# EAGLE design CS-P-USB (EAGLE 6.5.0)
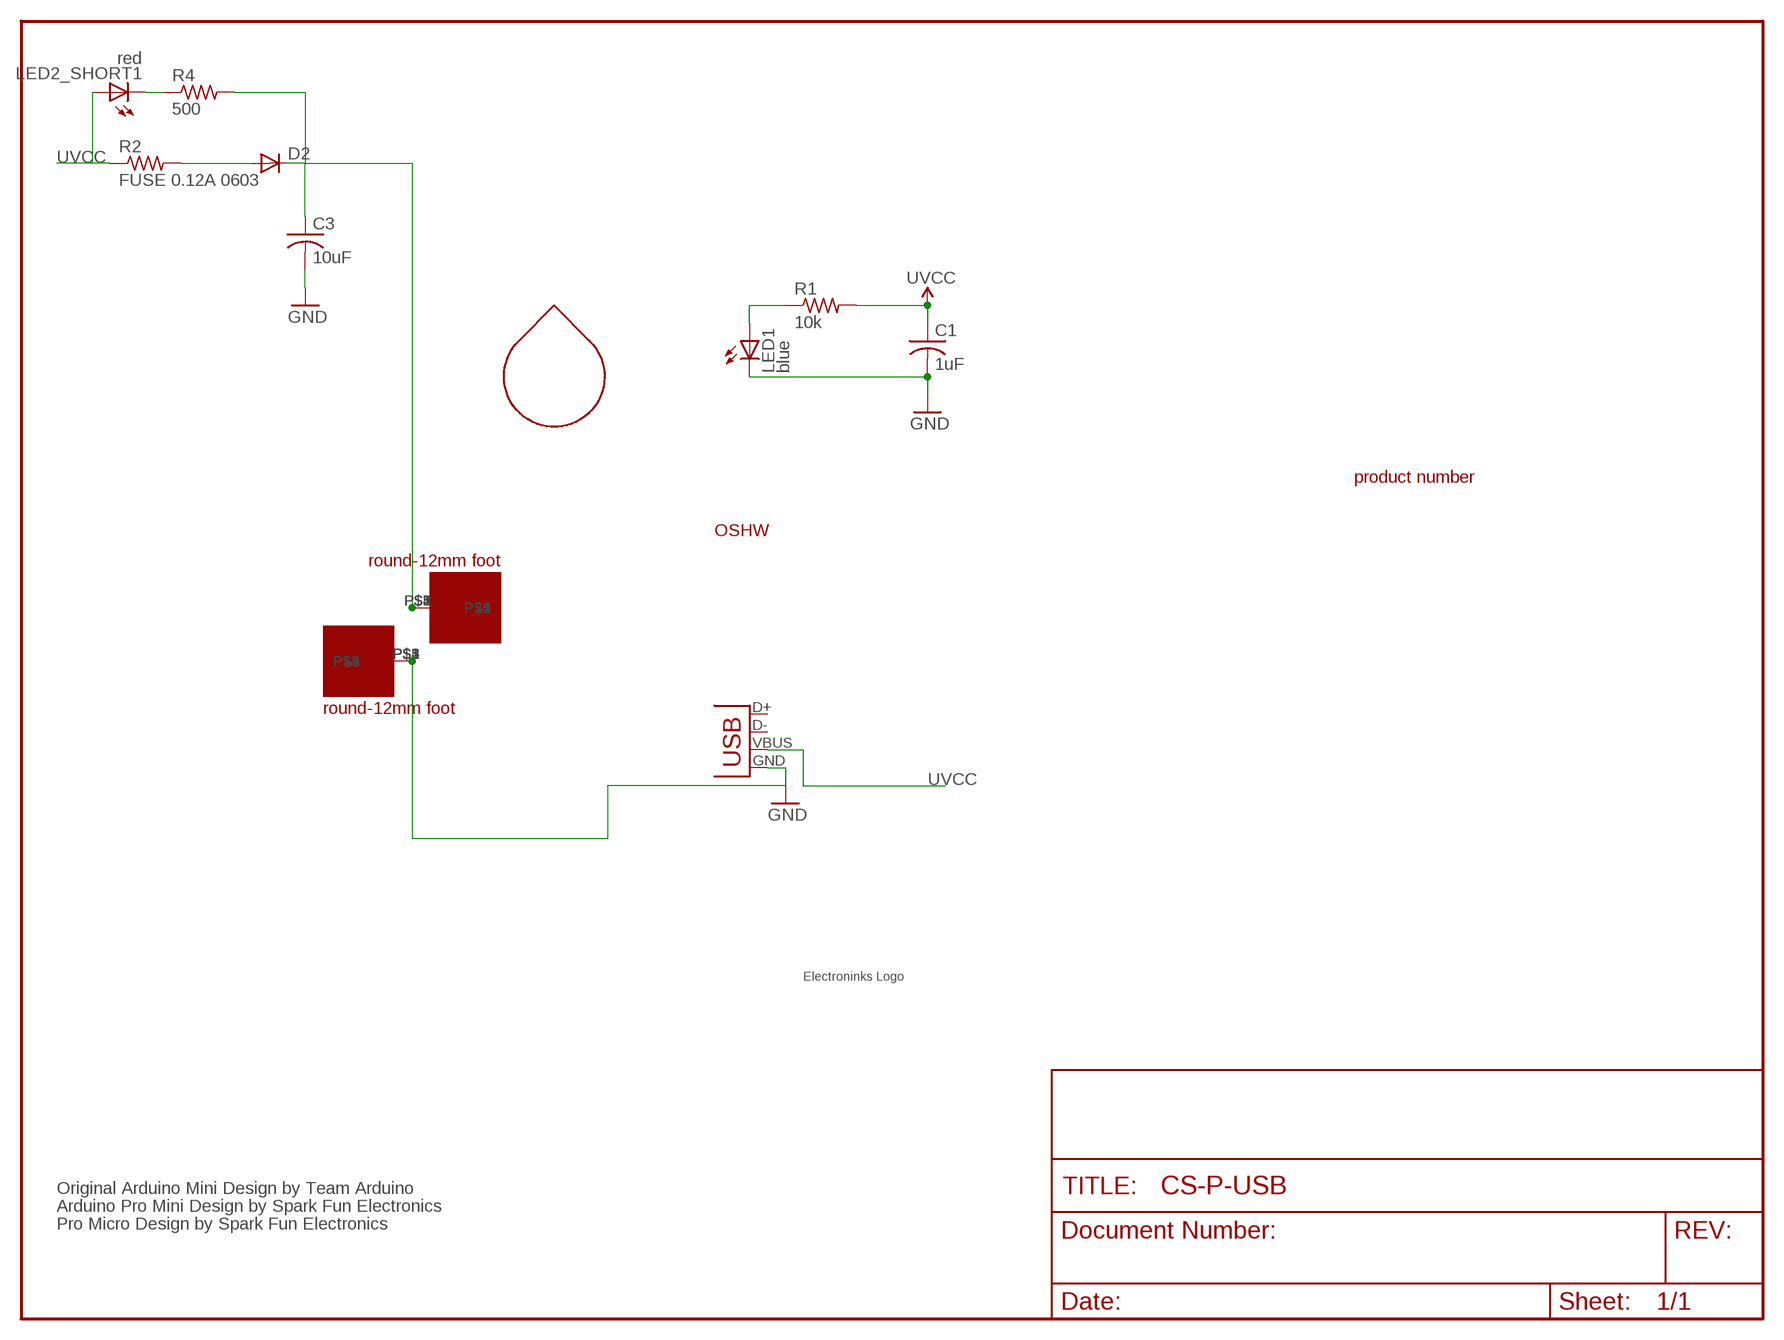
[diagram p0: schematic, sheet 1]

## Parts
C1  1uF  C-USC0603  [C0603]
C3  10uF  C-USC0805  [C0805]
D2  DIODESOD  [SOD-323]
LED1  blue  LEDSML0805  [SML0805]
LED2_SHORT1  red  LEDSML0805  [SML0805]
R1  10k  R-US_R0603  [R0603]
R2  FUSE 0.12A 0603  R-US_R0603  [R0603]
R4  500  R-US_R0603  [R0603]
U$1  ROUND-12MM-FOOT-1.8MM  [ROUND-12MM-FOOT]
U$2  ROUND-12MM-FOOT-1.8MM  [ROUND-12MM-FOOT]
U$3  DROPLET_LOGO_4MM  [DROPLET_LOGO_4MM]
U$4  OSHW_4MM  [OHSW_4MM]
U$5  CS_P_USB  [CS_P_USB]
U$6  ELECTRONINKS_LOGO_8MM  [ELECTRONINKS_LOGO_8MM]
X1  USB-MICROB  [USB-MICROB]

## Nets
GND [vcc]: C1.2 C3.2 LED1.C U$2.P$1 X1.GND
N$1: LED1.A R1.1
N$2: C3.1 D2.1(C) R4.2 U$1.P$1
N$3: D2.2(A) R2.2
N$7: LED2_SHORT1.C R4.1
UVCC: C1.1 LED2_SHORT1.A R1.2 R2.1 X1.VBUS
Unconnected: U$1.P$2 U$1.P$3 U$1.P$4 U$1.P$5 U$2.P$2 U$2.P$3 U$2.P$4 U$2.P$5 X1.D+ X1.D-

## Notes on the sheet
- Original Arduino Mini Design by Team Arduino
- Arduino Pro Mini Design by Spark Fun Electronics
- Pro Micro Design by Spark Fun Electronics

## Library data of the parts
C1 C3 = rcl:C-US: CAPACITOR, American symbol
D2 = SparkFun:DIODE: Diode These are standard reverse protection diodes and small signal diodes. SMA package can handle up to about 1A. SOD-323 can handle about 200mA. What the SOD-323 package when ordering, there are some mfgs out there that are 5-pin packages.
LED1 LED2_SHORT1 = led:LED: LED OSRAM: - CHIPLED LG R971, LG N971, LY N971, LG Q971, LY Q971, LO R971, LY R971 LH N974, LH R974 LS Q976, LO Q976, LY Q976 LO Q996 - Hyper CHIPLED LW Q18S LB Q993, LB Q99A, LB R99A - SideLED LS A670, LO A670, LY A670, LG A670, LP A670 LB A673, LV A673, LT A673, LW A673 LH A674 LY A675 LS A676, LA A676, LO A676, LY A676, LW A676 LS A679, LY A679, LG A679 - Hyper Micro SIDELED® LS Y876, LA Y876, LO Y876, LY Y876 LT Y87S - SmartLED LW L88C, LW L88S LB L89C, LB L89S, LG L890 LS L89K, LO L89K, LY L89K LS L896, LA L896, LO L896, LY L896 - TOPLED LS T670, LO T670, LY T670, LG T670, LP T670 LSG T670, LSP T670, LSY T670, LOP T670, LYG T670 LG T671, LOG T671, LSG T671 LB T673, LV T673, LT T673, LW T673 LH T674 LS T676, LA T676, LO T676, LY T676, LB T676, LH T676, LSB T676, LW T676 LB T67C, LV T67C, LT T67C, LS T67K, LO T67K, LY T67K, LW E67C LS E67B, LA E67B, LO E67B, LY E67B, LB E67C, LV E67C, LT E67C LW T67C LS T679, LY T679, LG T679 LS T770, LO T770, LY T770, LG T770, LP T770 LB T773, LV T773, LT T773, LW T773 LH T774 LS E675, LA E675, LY E675, LS T675 LS T776, LA T776, LO T776, LY T776, LB T776 LHGB T686 LT T68C, LB T68C - Hyper Mini TOPLED® LB M676 - Mini TOPLED Santana® LG M470 LS M47K, LO M47K, LY M47K Source: http://www.osram.convergy.de LUXEON: - LUMILED® LXK2-PW12-R00, LXK2-PW12-S00, LXK2-PW14-U00, LXK2-PW14-V00 LXK2-PM12-R00, LXK2-PM12-S00, LXK2-PM14-U00 LXK2-PE12-Q00, LXK2-PE12-R00, LXK2-PE12-S00, LXK2-PE14-T00, LXK2-PE14-U00 LXK2-PB12-K00, LXK2-PB12-L00, LXK2-PB12-M00, LXK2-PB14-N00, LXK2-PB14-P00, LXK2-PB14-Q00 LXK2-PR12-L00, LXK2-PR12-M00, LXK2-PR14-Q00, LXK2-PR14-R00 LXK2-PD12-Q00, LXK2-PD12-R00, LXK2-PD12-S00 LXK2-PH12-R00, LXK2-PH12-S00 LXK2-PL12-P00, LXK2-PL12-Q00, LXK2-PL12-R00 Source: www.luxeon.com KINGBRIGHT: KA-3528ASYC Source: www.kingbright.com
R1 R2 R4 = rcl:R-US_: RESISTOR, American symbol
U$1 U$2 = electroninks:ROUND-12MM-FOOT-1.8MM
U$3 = electroninks:DROPLET_LOGO_4MM
U$4 = electroninks:OSHW_4MM
U$5 = electroninks:CS_P_USB
U$6 = electroninks:ELECTRONINKS_LOGO_8MM
X1 = SparkFun:USB: USB Connectors USB-B-PTH is fully proven SKU : PRT-00139 USB-miniB is fully proven SKU : PRT-00587 USB-A-PCB is untested. USB-A-H is throughly reviewed, but untested. Spark Fun Electronics SKU : PRT-00437 USB-B-SMT is throughly reviewed, but untested. Needs silkscreen touching up. USB-A-S has not been used/tested USB-MB-H has not been used/tested

## Net classes
0 default: width 0.203 mm

## Board
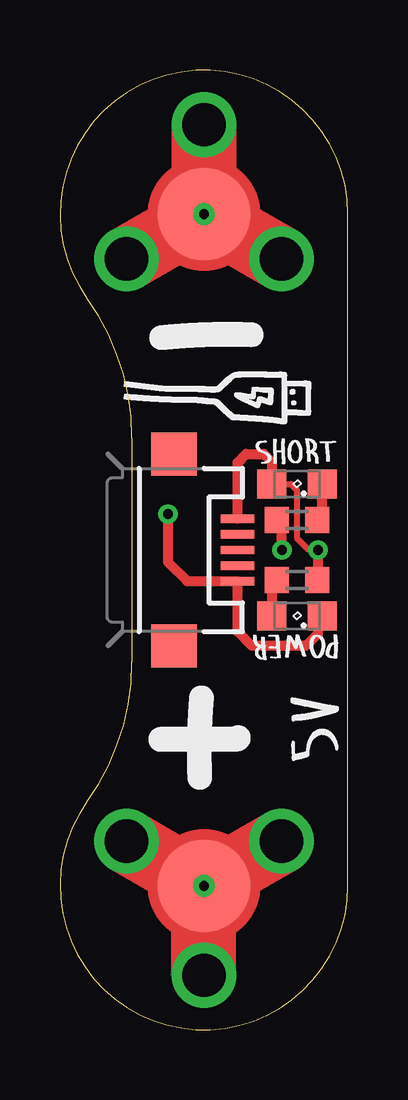
[diagram p1: board, top side]
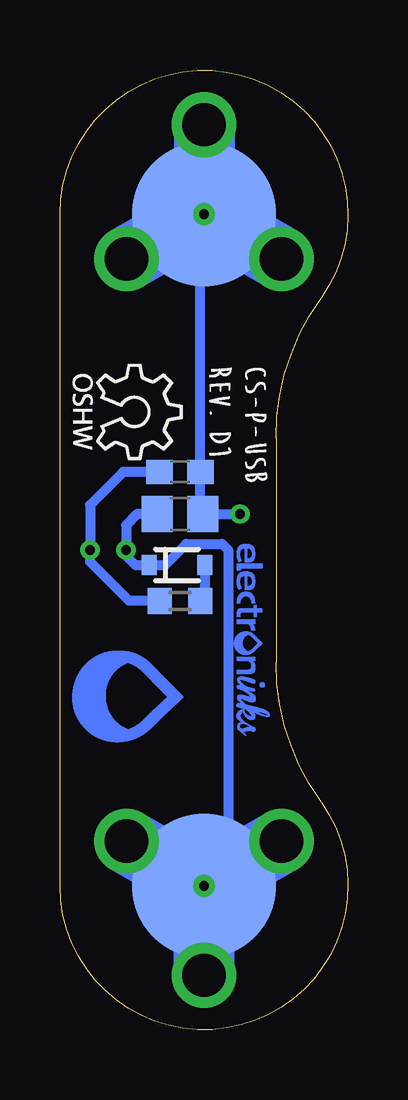
[diagram p2: board, bottom side, seen from below]

Size 12 x 39.99 mm. Coordinates in mm from the lower left corner, seen from the top.
Outline: 1.12,9.49 arc216 12,5.99 12,33.99 arc216 1.12,30.5 arc-36 3,24.67 3,15.32 arc-36 1.12,9.49
Copper layers (1*16): Top 0.035mm / dielectric 1.5mm / Bottom 0.035mm
Design rules "default": minimum track width 10mil, minimum drill 24mil, track to track 8mil, track to pad 8mil, pad to pad 8mil, via to via 8mil, smd to smd 8mil, copper to edge 40mil, drill to drill 8mil, minimum pad ring 10mil, minimum via ring 8mil, stop-mask expansion 4mil, vias tented up to drill 0mil, thermal gap 10mil

### Footprints (pad centres in the part's own frame; a part is rotated, then mirrored left to right if it is on the bottom)
C0603 = smd 1.1 x 1: 1 -0.85,0; 2 0.85,0
C0805 = smd 1.3 x 1.5: 1 -0.95,0; 2 0.95,0
SOD-323 = smd 0.63 x 0.83: 1 -1.15,0; 2 1.15,0
SML0805 = smd 1.2 x 1.2: A 1.05,0; C -1.05,0
R0603 = smd 1 x 1.1: 1 -0.85,0; 2 0.85,0
ROUND-12MM-FOOT = drill 1.8: P$1 -3.726,0; P$2 1.863,3.227; P$3 1.863,-3.227 | smd 3.85 x 3.85: P$4 0,0 | smd 6 x 6 bottom: P$5 0,0 | drill 0.4: P$6 0,0
USB-MICROB = smd 0.35 x 1.4: D+ 0,2.65; D- -0.65,2.65; GND 1.3,2.65; ID 0.65,2.65; VBUS -1.3,2.65 | smd 1.8 x 1.9: MT1 -4,0; MT2 4,0

### Placement (x,y rotation side)
C1  7,23.24 0 bottom
C3  7,21.49 0 bottom
D2  7.12,19.37 0 bottom
LED1  9.87,17.24 180 top
LED2_SHORT1  9.87,22.74 180 top
R1  9.87,18.74 0 top
R2  7,17.87 0 bottom
R4  9.87,21.24 180 top
U$1  6,5.99 90 top
U$2  6,33.99 270 top
U$3  10,13.87 270 bottom
U$4  11.75,27.74 270 bottom
U$5  6.02,27.71 270 bottom
U$6  4.75,20.24 270 bottom
X1  4.75,19.99 270 top

### Tracks (layer width: path | path; a pad name or v marks a point on that pad's centre or on a via)
GND  (via drill 0.4)
  Top 0.35: LED1.C 10.75,17.04
  Top 0.406: v4.5,21.49 4.5,19.49 5.3,18.69 X1.GND 7.4,16.59 8,15.99 10.25,15.99 10.75,16.49 10.75,17.04
  Bottom 0.406: 6.4,33.59 6,33.99 6.15,33.99 C1.2 6.15,21.59 C3.2 v4.5,21.49
N$1
  Top 0.406: R1.1 8.82,18.54 LED1.A
N$2  (via drill 0.4)
  Top 0.406: v9.25,19.99 9.25,21.14 R4.2
  Bottom 0.406: C3.1 8.77,21.49 9.25,21.02 v9.25,19.99 9.25,19.74 8.87,19.37 D2.1 7.62,19.37 6.75,20.24 5.25,20.24 5,19.99 5,5.99 6,5.99 5.25,5.99
N$3
  Bottom 0.406: D2.2 5.97,18.37 R2.2
N$7
  Top 0.406: R4.1 10.8,21.29 10.92,21.42 LED2_SHORT1.C
UVCC  (via drill 0.4)
  Top 0.254: LED2_SHORT1.A 9.62,22.74 9.87,22.49 9.87,20.49 10.37,19.99 v10.75,19.99
  Top 0.406: X1.VBUS 7.4,23.64 7.75,23.99 8.5,23.99 8.82,23.67 LED2_SHORT1.A | 11,18.74 R1.2 10.75,18.84 v10.75,19.99
  Bottom 0.406: C1.1 9.37,23.24 10.75,21.87 v10.75,19.99 10.75,19.49 9.12,17.87 R2.1